# Altium schematic sheet PowerRouting.SchDoc: PowerRouting
size A4; Date: JUN 2020; ApprovedBy: Hören; CheckedBy: Mörz; Author: Rudziński; CompanyName: Semi-ATE; DrawnBy: Rudziński; Engineer: Hören; Organization: Semi-ATE; DocumentNumber: 5; Revision: V1.0; SheetNumber: 5; SheetTotal: 20
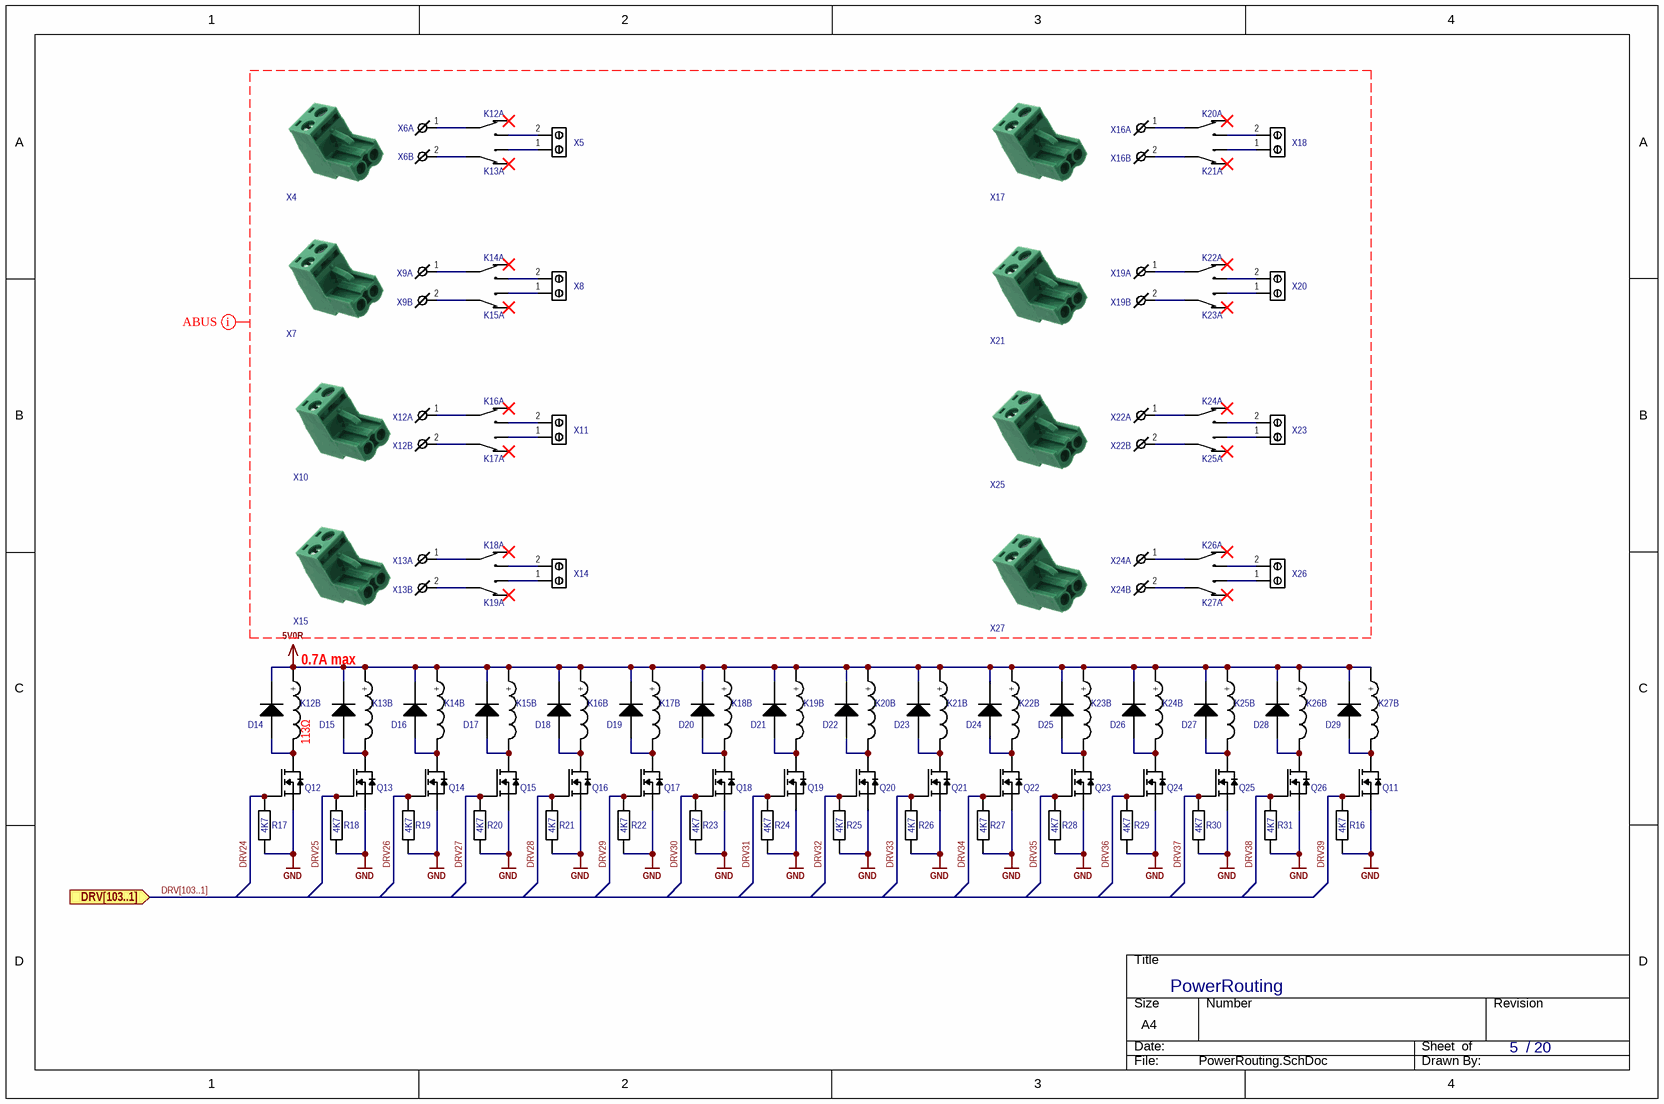
[diagram p0: PowerRouting.SchDoc]

## Parts
D14  D  [SOD123]  (value not drawn)
D15  D  [SOD123]  (value not drawn)
D16  D  [SOD123]  (value not drawn)
D17  D  [SOD123]  (value not drawn)
D18  D  [SOD123]  (value not drawn)
D19  D  [SOD123]  (value not drawn)
D20  D  [SOD123]  (value not drawn)
D21  D  [SOD123]  (value not drawn)
D22  D  [SOD123]  (value not drawn)
D23  D  [SOD123]  (value not drawn)
D24  D  [SOD123]  (value not drawn)
D25  D  [SOD123]  (value not drawn)
D26  D  [SOD123]  (value not drawn)
D27  D  [SOD123]  (value not drawn)
D28  D  [SOD123]  (value not drawn)
D29  D  [SOD123]  (value not drawn)
K12  K  [HF118F005-1ZS1]  (value not drawn)  (parts A,B of 2)
K13  K  [HF118F005-1ZS1]  (value not drawn)  (parts A,B of 2)
K14  K  [HF118F005-1ZS1]  (value not drawn)  (parts A,B of 2)
K15  K  [HF118F005-1ZS1]  (value not drawn)  (parts A,B of 2)
K16  K  [HF118F005-1ZS1]  (value not drawn)  (parts A,B of 2)
K17  K  [HF118F005-1ZS1]  (value not drawn)  (parts A,B of 2)
K18  K  [HF118F005-1ZS1]  (value not drawn)  (parts A,B of 2)
K19  K  [HF118F005-1ZS1]  (value not drawn)  (parts A,B of 2)
K20  K  [HF118F005-1ZS1]  (value not drawn)  (parts A,B of 2)
K21  K  [HF118F005-1ZS1]  (value not drawn)  (parts A,B of 2)
K22  K  [HF118F005-1ZS1]  (value not drawn)  (parts A,B of 2)
K23  K  [HF118F005-1ZS1]  (value not drawn)  (parts A,B of 2)
K24  K  [HF118F005-1ZS1]  (value not drawn)  (parts A,B of 2)
K25  K  [HF118F005-1ZS1]  (value not drawn)  (parts A,B of 2)
K26  K  [HF118F005-1ZS1]  (value not drawn)  (parts A,B of 2)
K27  K  [HF118F005-1ZS1]  (value not drawn)  (parts A,B of 2)
Q11  Q  [SOT23-3]  (value not drawn)
Q12  Q  [SOT23-3]  (value not drawn)
Q13  Q  [SOT23-3]  (value not drawn)
Q14  Q  [SOT23-3]  (value not drawn)
Q15  Q  [SOT23-3]  (value not drawn)
Q16  Q  [SOT23-3]  (value not drawn)
Q17  Q  [SOT23-3]  (value not drawn)
Q18  Q  [SOT23-3]  (value not drawn)
Q19  Q  [SOT23-3]  (value not drawn)
Q20  Q  [SOT23-3]  (value not drawn)
Q21  Q  [SOT23-3]  (value not drawn)
Q22  Q  [SOT23-3]  (value not drawn)
Q23  Q  [SOT23-3]  (value not drawn)
Q24  Q  [SOT23-3]  (value not drawn)
Q25  Q  [SOT23-3]  (value not drawn)
Q26  Q  [SOT23-3]  (value not drawn)
R16  value 4K7  [R0603 Reflow]  (hidden comment: R)
R17  value 4K7  [R0603 Reflow]  (hidden comment: R)
R18  value 4K7  [R0603 Reflow]  (hidden comment: R)
R19  value 4K7  [R0603 Reflow]  (hidden comment: R)
R20  value 4K7  [R0603 Reflow]  (hidden comment: R)
R21  value 4K7  [R0603 Reflow]  (hidden comment: R)
R22  value 4K7  [R0603 Reflow]  (hidden comment: R)
R23  value 4K7  [R0603 Reflow]  (hidden comment: R)
R24  value 4K7  [R0603 Reflow]  (hidden comment: R)
R25  value 4K7  [R0603 Reflow]  (hidden comment: R)
R26  value 4K7  [R0603 Reflow]  (hidden comment: R)
R27  value 4K7  [R0603 Reflow]  (hidden comment: R)
R28  value 4K7  [R0603 Reflow]  (hidden comment: R)
R29  value 4K7  [R0603 Reflow]  (hidden comment: R)
R30  value 4K7  [R0603 Reflow]  (hidden comment: R)
R31  value 4K7  [R0603 Reflow]  (hidden comment: R)
X4  X  [691352710002]  (value not drawn)
X5  X  [1731721]  (value not drawn)
X6  X  [691312710002]  (value not drawn)  (parts A,B of 2)
X7  X  [691352710002]  (value not drawn)
X8  X  [1731721]  (value not drawn)
X9  X  [691312710002]  (value not drawn)  (parts A,B of 2)
X10  X  [691352710002]  (value not drawn)
X11  X  [1731721]  (value not drawn)
X12  X  [691312710002]  (value not drawn)  (parts A,B of 2)
X13  X  [691312710002]  (value not drawn)  (parts A,B of 2)
X14  X  [1731721]  (value not drawn)
X15  X  [691352710002]  (value not drawn)
X16  X  [691312710002]  (value not drawn)  (parts A,B of 2)
X17  X  [691352710002]  (value not drawn)
X18  X  [1731721]  (value not drawn)
X19  X  [691312710002]  (value not drawn)  (parts A,B of 2)
X20  X  [1731721]  (value not drawn)
X21  X  [691352710002]  (value not drawn)
X22  X  [691312710002]  (value not drawn)  (parts A,B of 2)
X23  X  [1731721]  (value not drawn)
X24  X  [691312710002]  (value not drawn)  (parts A,B of 2)
X25  X  [691352710002]  (value not drawn)
X26  X  [1731721]  (value not drawn)
X27  X  [691352710002]  (value not drawn)

## Ports
DRV[103..1] (in)

## Nets
5V0R: D14.2(C) D15.2(C) D16.2(C) D17.2(C) D18.2(C) D19.2(C) D20.2(C) D21.2(C) D22.2(C) D23.2(C) D24.2(C) D25.2(C) D26.2(C) D27.2(C) D28.2(C) D29.2(C) K12.1(+) K13.1(+) K14.1(+) K15.1(+) K16.1(+) K17.1(+) K18.1(+) K19.1(+) K20.1(+) K21.1(+) K22.1(+) K23.1(+) K24.1(+) K25.1(+) K26.1(+) K27.1(+)
GND: Q11.2(S) Q12.2(S) Q13.2(S) Q14.2(S) Q15.2(S) Q16.2(S) Q17.2(S) Q18.2(S) Q19.2(S) Q20.2(S) Q21.2(S) Q22.2(S) Q23.2(S) Q24.2(S) Q25.2(S) Q26.2(S) R16.1 R17.1 R18.1 R19.1 R20.1 R21.1 R22.1 R23.1 R24.1 R25.1 R26.1 R27.1 R28.1 R29.1 R30.1 R31.1
DRV24: Q12.1(G) R17.2
DRV25: Q13.1(G) R18.2
DRV26: Q14.1(G) R19.2
DRV27: Q15.1(G) R20.2
DRV28: Q16.1(G) R21.2
DRV29: Q17.1(G) R22.2
DRV30: Q18.1(G) R23.2
DRV31: Q19.1(G) R24.2
DRV32: Q20.1(G) R25.2
DRV33: Q21.1(G) R26.2
DRV34: Q22.1(G) R27.2
DRV35: Q23.1(G) R28.2
DRV36: Q24.1(G) R29.2
DRV37: Q25.1(G) R30.2
DRV38: Q26.1(G) R31.2
DRV39: Q11.1(G) R16.2
NetD14_1: D14.1(A) K12.5(-) Q12.3(D)
NetD15_1: D15.1(A) K13.5(-) Q13.3(D)
NetD16_1: D16.1(A) K14.5(-) Q14.3(D)
NetD17_1: D17.1(A) K15.5(-) Q15.3(D)
NetD18_1: D18.1(A) K16.5(-) Q16.3(D)
NetD19_1: D19.1(A) K17.5(-) Q17.3(D)
NetD20_1: D20.1(A) K18.5(-) Q18.3(D)
NetD21_1: D21.1(A) K19.5(-) Q19.3(D)
NetD22_1: D22.1(A) K20.5(-) Q20.3(D)
NetD23_1: D23.1(A) K21.5(-) Q21.3(D)
NetD24_1: D24.1(A) K22.5(-) Q22.3(D)
NetD25_1: D25.1(A) K23.5(-) Q23.3(D)
NetD26_1: D26.1(A) K24.5(-) Q24.3(D)
NetD27_1: D27.1(A) K25.5(-) Q25.3(D)
NetD28_1: D28.1(A) K26.5(-) Q26.3(D)
NetD29_1: D29.1(A) K27.5(-) Q11.3(D)
NetK12_2: K12.2(Cin) X6.1(+)
NetK12_3: K12.3(Cno) X5.2
NetK13_2: K13.2(Cin) X6.2(-)
NetK13_3: K13.3(Cno) X5.1
NetK14_2: K14.2(Cin) X9.1(+)
NetK14_3: K14.3(Cno) X8.2
NetK15_2: K15.2(Cin) X9.2(-)
NetK15_3: K15.3(Cno) X8.1
NetK16_2: K16.2(Cin) X12.1(+)
NetK16_3: K16.3(Cno) X11.2
NetK17_2: K17.2(Cin) X12.2(-)
NetK17_3: K17.3(Cno) X11.1
NetK18_2: K18.2(Cin) X13.1(+)
NetK18_3: K18.3(Cno) X14.2
NetK19_2: K19.2(Cin) X13.2(-)
NetK19_3: K19.3(Cno) X14.1
NetK20_2: K20.2(Cin) X16.1(+)
NetK20_3: K20.3(Cno) X18.2
NetK21_2: K21.2(Cin) X16.2(-)
NetK21_3: K21.3(Cno) X18.1
NetK22_2: K22.2(Cin) X19.1(+)
NetK22_3: K22.3(Cno) X20.2
NetK23_2: K23.2(Cin) X19.2(-)
NetK23_3: K23.3(Cno) X20.1
NetK24_2: K24.2(Cin) X22.1(+)
NetK24_3: K24.3(Cno) X23.2
NetK25_2: K25.2(Cin) X22.2(-)
NetK25_3: K25.3(Cno) X23.1
NetK26_2: K26.2(Cin) X24.1(+)
NetK26_3: K26.3(Cno) X26.2
NetK27_2: K27.2(Cin) X24.2(-)
NetK27_3: K27.3(Cno) X26.1

Not connected (* = marked no-connect by the designer): K12 4(Cnc)*; K13 4(Cnc)*; K14 4(Cnc)*; K15 4(Cnc)*; K16 4(Cnc)*; K17 4(Cnc)*; K18 4(Cnc)*; K19 4(Cnc)*; K20 4(Cnc)*; K21 4(Cnc)*; K22 4(Cnc)*; K23 4(Cnc)*; K24 4(Cnc)*; K25 4(Cnc)*; K26 4(Cnc)*; K27 4(Cnc)*

## Buses and harness runs
bus DRV[103..1] = port DRV[103..1]

## Layout directives
net class ABUS: (no net found under the mark)

## Notes on the sheet
- 0.7A max
- /
- designed by
- reviewed by
- last drawn by
- Project:
- Schematic:
- last printed
- DIN-A4 L
- sheets
- of
- File:

## Library data of the parts
D14-D29 = 1N4148W: DIODE GEN PURP 100V 300MA SOD123; 04. Manufacturer: Diodes Incorporated; 07. Manufacturer  Part Number: 1N4148W-7-F; 03. Unit Price: 0.14; 01. Distributor: DigiKey; 02. Distributor Part Number: 1N4148W-FDICT-ND; 11. RoHS: YES; ComponentLink1Description: Info; ComponentLink1URL: https://www.digikey.de/product-detail/en/nexperia-usa-inc/PMEG4050EP115/1727-5842-6-ND/2697559; ComponentLink2Description: DataSheet; ComponentLink2URL: https://assets.nexperia.com/documents/data-sheet/PMEG4050EP.pdf
K12-K27 = HF118F005-1ZS1: 5V Power Relay, switch over; 04. Manufacturer: Hongfa Europe GMBH; 07. Manufacturer  Part Number: HF118F/005-1ZS1T(136); 03. Unit Price: 2.60; 13. Created Date/Name: AUG2018/Hören; Coil Resistance: 113Ω; Max Carry Current: 10A; Max Switch Voltage: 440Vac/125Vdc; Power Rating: 300Wdc/2.5KVAac; 01. Distributor: RS-Components; 02. Distributor Part Number: 176-2821; 09. Operating Temperature: -xx..+yy°C; 11. RoHS: YES; ComponentLink1Description: Info; ComponentLink1URL: https://de.rs-online.com/web/p/monostabile-relais/1762821/; ComponentLink2Description: DataSheet; ComponentLink2URL: https://docs.rs-online.com/c37d/0900766b81663e9a.pdf; Coil Voltage: 5V; Max Switch Current: 10A
Q11-Q26 = FDV303N: MOSFET N-CH 25V 680MA SOT-23; 04. Manufacturer: ON Semiconductor; 03. Unit Price: 0.41; 13. Created Date/Name: AUG 2018 / Hören; Rds On: 450 mΩ @ id=500mA & Vgs=4.5V; Vgs,th: 1.5V @ 250uA; Power Rating: 350mW; 3D-Export: No; 01. Distributor: DigiKey; 02. Distributor Part Number: FDV303NDKR-ND; 07. Manufacturer  Part Number: FDV303N; 09. Operating Temperature: -55°C ~ 150°C (TJ); 11. RoHS: YES; ComponentLink1Description: Info; ComponentLink1URL: https://www.digikey.de/product-detail/en/on-semiconductor/FDV303N/FDV303NDKR-ND/1630434; ComponentLink2Description: DataSheet; ComponentLink2URL: https://media.digikey.com/pdf/Data%20Sheets/Fairchild%20PDFs/FDV303N.pdf; Vdss: 25V; Id: 680mA
R16-R31 = R: RES SMD 4.7K OHM 1% 1/10W 0603; 04. Manufacturer: Yageo; 07. Manufacturer  Part Number: RC0603FR-074K7L; 03. Unit Price: 0.09; 13. Created Date/Name: AUG2018/Hören; Tolerance: ±1%; ComponentLink1URL: *; ComponentLink1Description: Info; 02. Distributor Part Number: 311-4.70KHRCT-ND; 09. Operating Temperature: -xx..+yy°C; 11. RoHS: ???; 01. Distributor: DigiKey; ComponentLink2Description: DataSheet; Package: *
X4 X7 X10 X15 X17 X21 X25 X27 = 691352710002: TERM BLOCK PLUG 2POS STR 5MM; 04. Manufacturer: Würth Elektronik; 03. Unit Price: 1.1; 13. Created Date/Name: ??? / Hören; System: Connector; 01. Distributor: DigiKey; 02. Distributor Part Number: 732-2775-ND; 07. Manufacturer  Part Number: 691352710002; ComponentLink1Description: Info; ComponentLink1URL: https://www.digikey.de/products/en?keywords=691352710002; ComponentLink2Description: DataSheet; ComponentLink2URL: https://www.we-online.de/katalog/datasheet/6913527100xx.pdf
X5 X8 X11 X14 X18 X20 X23 X26 = 1731721: TERM BLK 2P SIDE ENT 7.62MM PCB; 04. Manufacturer: Phoenix Contact; 03. Unit Price: 2.12; 13. Created Date/Name: JAN 2019 / Hören; System: Connector; 01. Distributor: DigiKey; 02. Distributor Part Number: 277-5849-ND; 07. Manufacturer  Part Number: 1731721; 11. RoHS: YES; ComponentLink1Description: Info; ComponentLink1URL: https://www.digikey.de/products/en?keywords=1731721; ComponentLink2Description: DataSheet; ComponentLink2URL: https://media.digikey.com/pdf/Data%20Sheets/Phoenix%20Contact%20PDFs/1731721.pdf
X6 X9 X12 X13 X16 X19 X22 X24 = 691312710002: TERM BLOCK HDR 2POS 90DEG 5MM; 04. Manufacturer: Würth Elektronik; 03. Unit Price: 0.244; 13. Created Date/Name: ??? / Hören; System: Connector; 01. Distributor: DigiKey; 02. Distributor Part Number: 732-2805-ND; 07. Manufacturer  Part Number: 691312710002; ComponentLink1Description: Info; ComponentLink2Description: DataSheet